# Altium schematic sheet POS.SchDoc
size A4; SheetNumber: 7; SheetTotal: 7
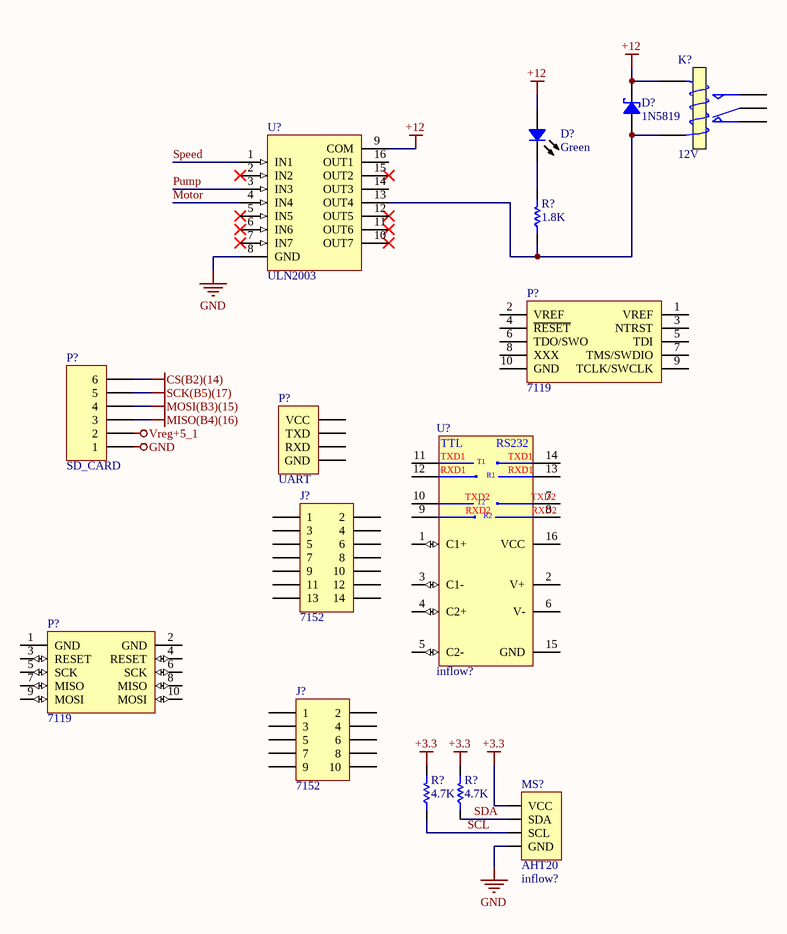
[diagram p0: POS.SchDoc]

## Parts
(Parts that share a designator on the sheet are numbered #1, #2 ... from top to bottom, then left to right.)
D?#1  Green  [LED 0805/2012 GREEN]
D?#2  1N5819  [430X270D]
J?#1  Inflow: 7152  [HDR_THT_7x2M_2.54mm]  (hidden comment: 7x2)
J?#2  Inflow: 7152  [HDR_THT_5x2M_2.54mm]  (hidden comment: 5x2)
K?  12V  [Relay 18.85x15.35x15.70]
MS?  Inflow: inflow?  [AHT20]  (hidden comment: AHT20)
P?#1  Inflow: 7119  [IDC2.54-10PIN]  (hidden comment: JTAG-10P)
P?#2  UART  [MOLEX KK 0022272041]
P?#3  SD_CARD  [MO-Header 6]
P?#4  Inflow: 7119  [IDC2.54-10PIN]  (hidden comment: JTAG, 10'Pin)
R?#1  1.8K  [RES 0805 (2012X06L)]
R?#2  4.7K  [RES 0805 (2012X06L)]
R?#3  4.7K  [RES 0805 (2012X06L)]
U?#1  ULN2003  [SO16_M]
U?#2  Inflow: inflow?  [NSO16_M]  (hidden comment: MAX3232)

## Nets
+3.3: MS?.4(VCC) R?#2.2 R?#3.2
+12: D?#1.1 D?#2.2 K?.5(T2) U?#1.9(COM)
CS(B2)(14): P?#3.6
GND: MS?.3(GND) P?#3.1 U?#1.8(GND)
MISO(B4)(16): P?#3.3
MOSI(B3)(15): P?#3.4
SCK(B5)(17): P?#3.5
Vreg+5_1: P?#3.2
Motor: U?#1.4(IN4)
Pump: U?#1.3(IN3)
SCL: MS?.2(SCL) R?#2.1
SDA: MS?.1(SDA) R?#3.1
Speed: U?#1.1(IN1)
NetD?#1_2: D?#1.2 R?#1.2
NetD?#2_1: D?#2.1 K?.4(T1) R?#1.1 U?#1.13(OUT4)

Not connected (* = marked no-connect by the designer): J?#1 1 2 3 4 5 6 7 8 9 10 11 12 13 14; J?#2 1 2 3 4 5 6 7 8 9 10; K? 1(COM) 2(NC) 3(NO); P?#1 1(VREF) 2(VREF) 3(NTRST) 4(~{RESET}) 5(TDI) 6(TDO/SWO) 7(TMS/SWDIO) 8(XXX) 9(TCLK/SWCLK) 10(GND); P?#2 1(VCC) 2(TXD) 3(RXD) 4(GND); P?#4 1(GND) 2(GND) 3(RESET) 4(RESET) 5(SCK) 6(SCK) 7(MISO) 8(MISO) 9(MOSI) 10(MOSI); U?#1 2(IN2)* 5(IN5)* 6(IN6)* 7(IN7)* 10(OUT7)* 11(OUT6)* 12(OUT5)* 14(OUT3) 15(OUT2)* 16(OUT1); U?#2 1(C1+) 2(V+) 3(C1-) 4(C2+) 5(C2-) 6(V-) 7(T2OUT) 8(R2IN) 9(R2OUT) 10(T2IN) 11(T1IN) 12(R1OUT) 13(R1IN) 14(T1OUT) 15(GND) 16(VCC)

## Notes on the sheet
- (in symbol IC_Converter_MAX3232CSE) TTL; TXD1; T1; RXD1; R1; TXD2; T2; RXD2; R2

## Library data of the parts
D?#1 = Semi_LED_SMD: LED; Inflow: inflow?; Rating: Rating?; Validation: Valid; Package: Package?; Type: LED; Value: Green
D?#2 = Semi_Diod_Sch_1N5819_SMD: Schottky Rectifiers; Rating: Rating?; Validation: Valid; Inflow: inflow?; Package: SMA; Type: Schottky; Value: 1N5819
J?#1 = Con_MPH_7x2_V_THT_2.54: Header, dual row, 14 pin; Rating: Rating?; Validation: NT; Value: 7x2; Package: Package?; Type: Type?
J?#2 = Con_MPH_5x2_V_THT_2.54: Header, dual row, 10 pin; Rating: Rating?; Validation: NT; Value: 5x2; Package: Package?; Type: Type?
K? = SW_Relay_SPDT: SPDT Relay; Rating: Rating?; Validation: Valid; Inflow: inflow?; Type: SPDT; Package: Dip; Value: 12V
MS? = ModSen_AHT20: Air Temperature and Humidity Sensor; Rating: Rating?; Validation: NT; Package: Dip; Type: Air T&H; Value: AHT20
P?#1 = Con_Prog_JTAG_10: 10 Pin Standard JTAG Header For ARM JLINK; Rating: Rating?; Validation: NT; Value: JTAG-10P; Package: Package?; Type: Type?
P?#2 = Con_UART: UART Connector; Rating: Rating?; Validation: Valid; Inflow: 4528; Package: Package?; Type: Type?; Value: UART
P?#3 = MO-Header 6
P?#4 = Con_Prog_USBasp: 10 Pin Standard ISP Header For TNM; Rating: Rating?; Validation: Valid; Value: JTAG, 10'Pin; Package: Package?; Type: Type?
R?#1-R?#3 = Res_SMD_0805: Resistor; Inflow: inflow?; Rating: 0.125W; Validation: Valid; Package: 0805; Type: 10%
  R?#1: Value: 1.8K
  R?#2 R?#3: Value: 4.7K
U?#1 = IC_Driver_ULN2003: Seven darlington array drivers; Rating: Rating?; Validation: Valid; Inflow: 1506; Package: SO-16; Type: Driver; Value: ULN2003
U?#2 = IC_Converter_MAX3232CSE: RS-232 Interface IC 3.0V to 5.5V, Low-Power, up to 1Mbps, True RS-232 Transceivers Using Four 0.1uF External Capacitors; Rating: Rating?; Validation: Valid; Value: MAX3232; Package: SOIC-16; Type: RS232